# Altium schematic sheet TopLevelSchematics.SchDoc: SAM
size A3; Author: Grégoire Henry; DrawnBy: Grégoire Henry; Organization: IPSA ONE; SheetNumber: 1; SheetTotal: 5
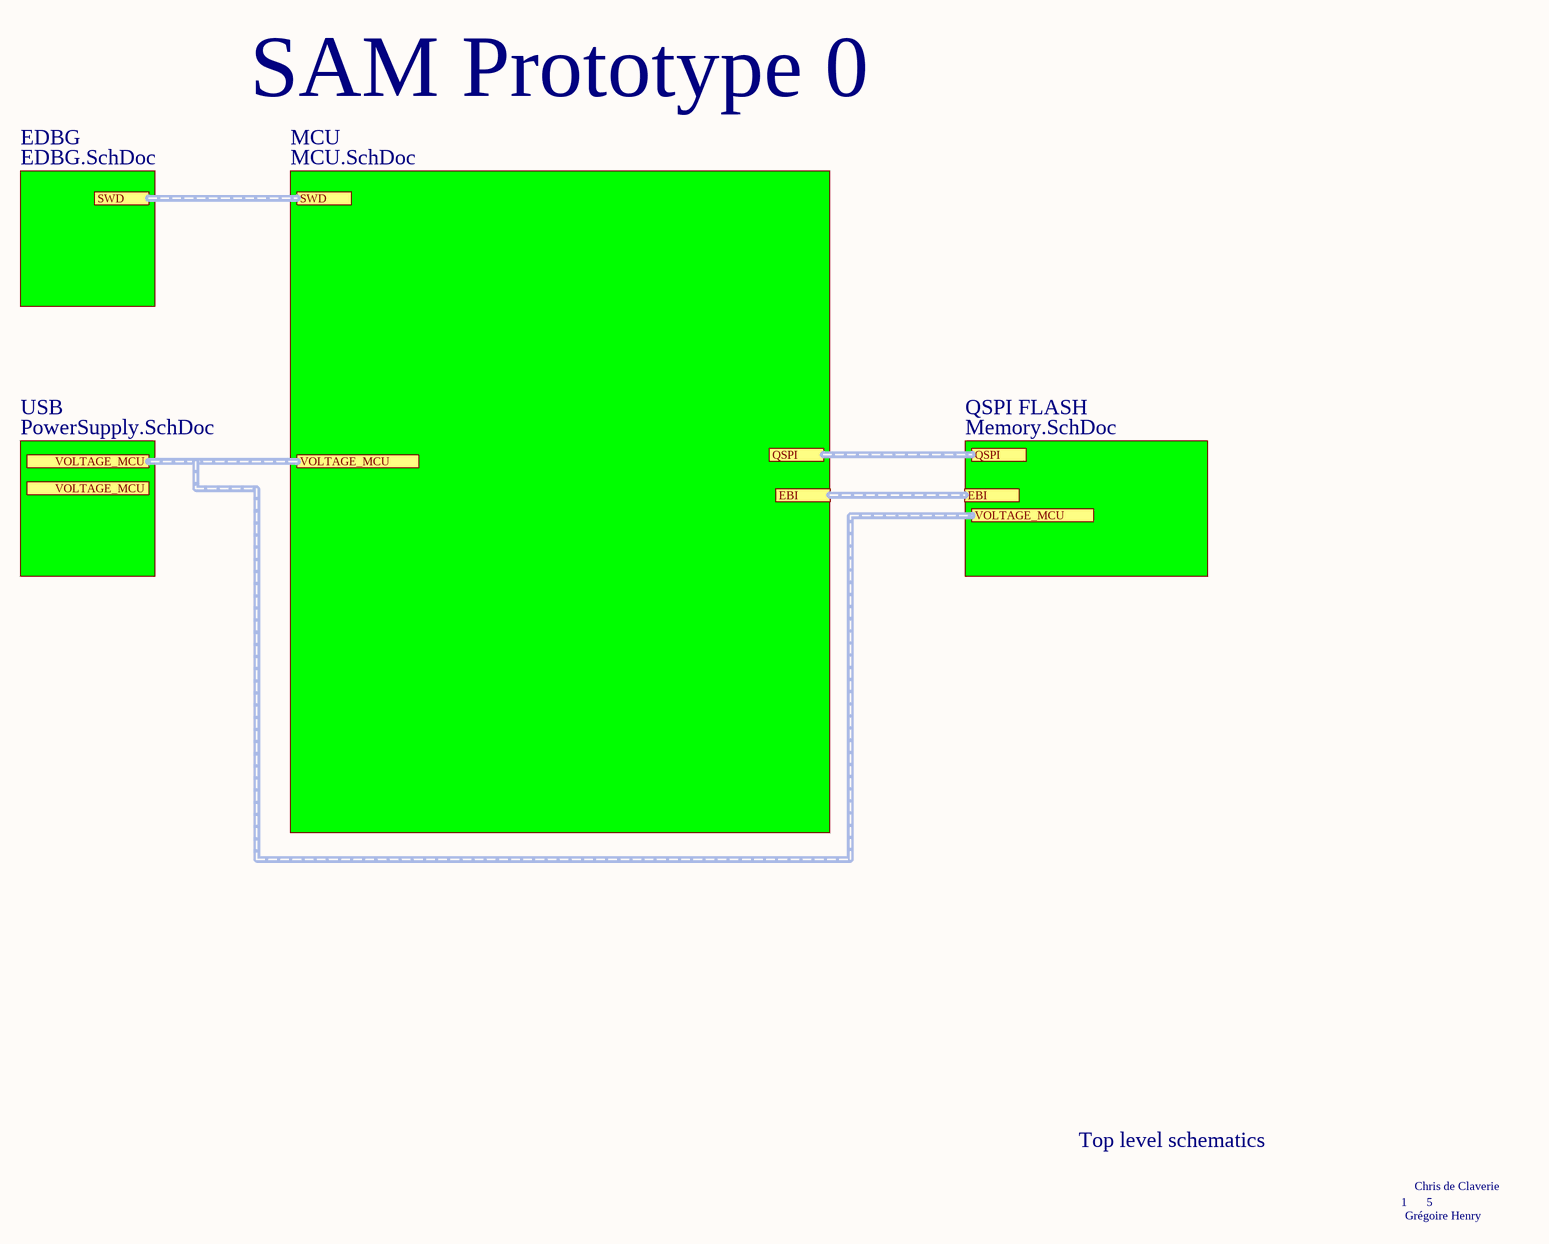
[diagram p0: TopLevelSchematics.SchDoc]

## Ports
EBI (harness *), QSPI (harness *), SWD (harness *), VOLTAGE_MCU (harness *)

## Notes on the sheet
- SAM Prototype 0
- EDBG.SchDoc
- EDBG
- MCU.SchDoc
- MCU
- PowerSupply.SchDoc
- USB
- Memory.SchDoc
- QSPI FLASH
- Top level schematics
- 1
- Chris de Claverie
- 5
- Grégoire Henry